# EAGLE design VCNL4000 (EAGLE 5.01)
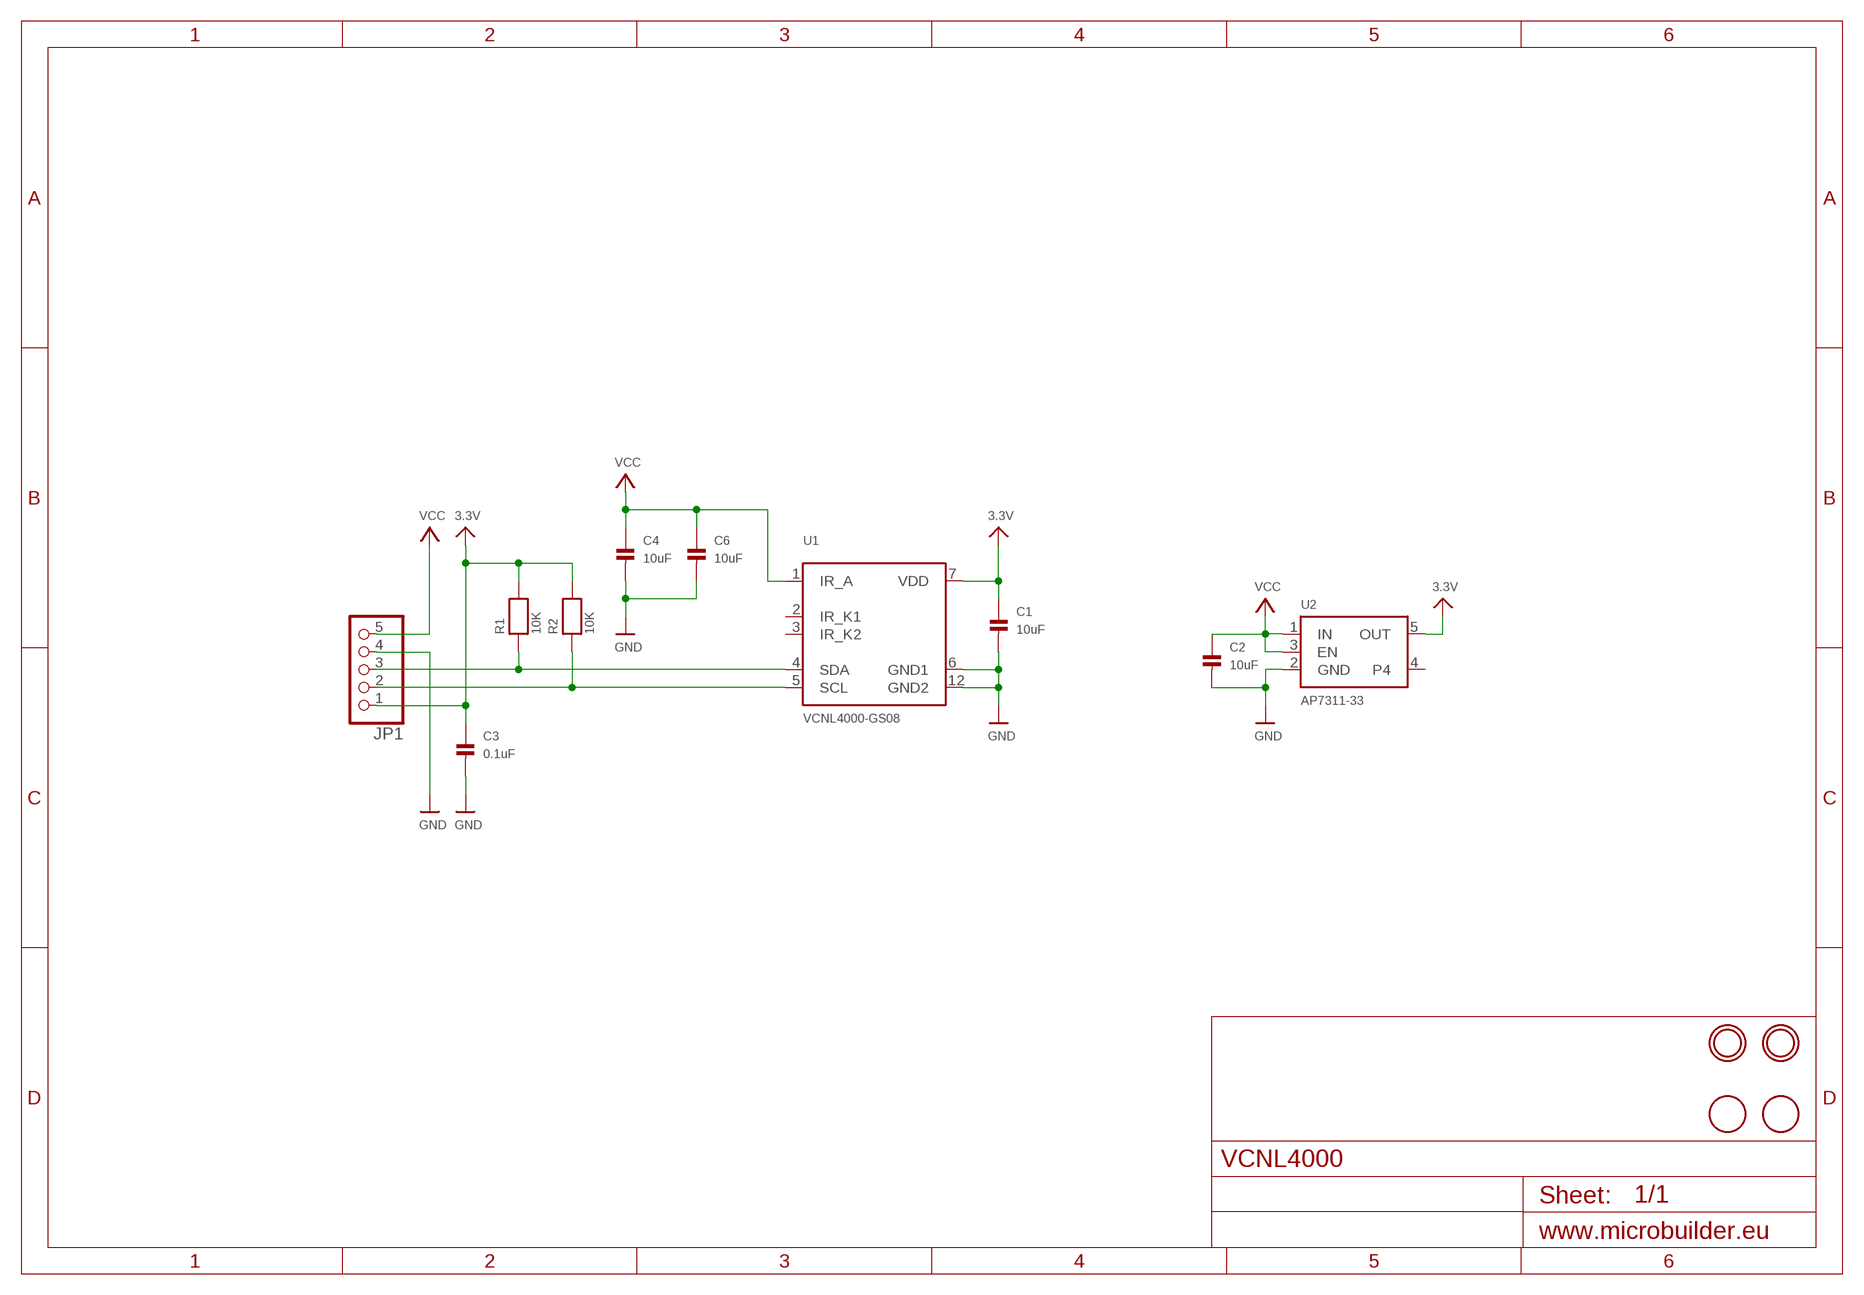
[diagram p0: schematic, sheet 1]

## Parts
C1  10uF  CAP_CERAMIC0805  [0805]
C2  10uF  CAP_CERAMIC0805  [0805]
C3  0.1uF  CAP_CERAMIC0805  [0805]
C4  10uF  CAP_CERAMIC0805  [0805]
C6  10uF  CAP_CERAMIC0805  [0805]
JP1  HEADER-1X576MIL  [1X05_ROUND_76]
R1  10K  RESISTOR0805  [0805]
R2  10K  RESISTOR0805  [0805]
U1  VCNL4000-GS08  VCNL4000  [VCNL4000]
U2  AP7311-33  VREG_SOT23-5  [SOT23-5]
U$5  MOUNTINGHOLE2.0  [MOUNTINGHOLE_2.0_PLATED]
U$6  MOUNTINGHOLE2.0  [MOUNTINGHOLE_2.0_PLATED]
U$7  FIDUCIAL  [FIDUCIAL_1MM]
U$8  FIDUCIAL  [FIDUCIAL_1MM]

## Nets
3.3V: C1.1 C3.1 JP1.1 R1.2 R2.2 U1.7(VDD) U2.5(OUT)
GND: C1.2 C2.2 C3.2 C4.2 C6.2 JP1.4 U1.6(GND1) U1.12(GND2) U2.2(GND)
SCL: JP1.2 R2.1 U1.5(SCL)
SDA: JP1.3 R1.1 U1.4(SDA)
VCC: C2.1 C4.1 C6.1 JP1.5 U1.1(IR_A) U2.1(IN) U2.3(EN)
Unconnected: U1.2(IR_K1) U1.3(IR_K2) U2.4

## Library data of the parts
C1-C4 C6 = microbuilder:CAP_CERAMIC: Ceramic Capacitors 0402 - 0402 Surface Mount Capacitors 16pF 50V 5% [Digikey: 445-4899-2-ND] 18pF 50V 5% [Digikey: 490-1281-2-ND] 22pF 50V 5% [Digikey: 490-1283-2-ND] 68pF 50V 5% [Digikey: 490-1289-2-ND] 0.1uF 10V 10% [Digikey: 490-1318-2-ND] 1.0uF 6.3V 10% [Digikey: 490-1320-2-ND] 0603 - 0603 Surface Mount Capacitors 16 pF 50V 5% [Digikey: 445-5051-2-ND] 22 pF 50V [Digikey: PCC220ACVTR-ND] 33 pF 50V 5% [Digikey: 490-1415-1-ND] 56pF 50V 5% [Digikey: 490-1421-1-ND] 220pF 50V 5% [Digikey: 445-1285-1-ND] 680 pF 50V 2200 pF 50V 5% C0G [Digikey: 445-1297-1-ND] 5600 pF 100V 5% X7R [Digikey: 478-3711-1-ND] 0.1 µF 25V 10% [Digikey: PCC2277TR-ND] 0.22 µF 16V 10% X7R [Digikey: 445-1318-1-ND] 1.0 µF 25V 10% [Digikey: 445-5146-2-ND] 0603 - RF Specific 3pF 250V +/-0.1pF RF [Digikey: 712-1347-1-ND] 18 pF 250V 5% [Digikey: 478-3505-1-ND or 712-1322-1-ND] 56 pF 250V 5% C0G RF [Digikey: 490-4867-1-ND] 68 pF 250V RF [Digikey: 490-4868-1-ND] 0805 - 0805 Surface Mount Capacitors 220 pF 250V 2% RF Ceramic Capacitor [Digikey: 712-1398-1-ND] 1000 pF 50V 2% NP0 Ceramic Capacitor [Digikey: 478-3760-1-ND] 0.1 µF 25V 10% Ceramic Capacitor [Digikey: PCC1828TR-ND] 1.0 µF 16V 10% Ceramic Capacitor[Digikey: 490-1691-2-ND] 10.0 µF 10V 10% Ceramic Capacitor[Digikey: 709-1228-1-ND] 10.0 uF 16V 10% Ceramic Capacitor [Digikey: 478-5165-2-ND] 47 uF 6.3V 20% Ceramic Capacitor [Digikey: 587-1779-1-ND or 399-5506-1-ND] 1206 - 1206 Surface Mount Capacitors 47uF 10V 20% Ceramic Capacitor [Digikey: 490-5528-1-ND or 399-5508-1-ND or 445-6010-1-ND] 100uF 6.3V -20%, +80% Y5V Ceramic Capacitor (Digikey: 490-4512-1-ND, Mouser: 81-GRM31CF50J107ZE1L)
JP1 = microbuilder:HEADER-1X5: PIN HEADER
R1 R2 = microbuilder:RESISTOR: Resistors 0402 - 0402 Surface Mount Package 22 Ohm 1% 1/16W [Digikey: 311-22.0LRTR-ND] 33 Ohm 5% 1/16W 1.0K 5% 1/16W 1.5K 5% 1/16W 2.0K 1% 1/16W 10.0K 1% 1/16W [Digikey: 311-10.0KLRTR-ND] 10.0K 5% 1/16W [Digikey: RMCF0402JT10K0TR-ND] 12.1K 1% 1/16W [Digikey: 311-22.0LRTR-ND] 100.0K 5% 1/16W 0603 - 0603 Surface Mount Package 0 Ohm 1/10 Watt 1% Resistor 15 Ohm 1/10 Watt 1% Resistor 33 Ohm 1/10 Watt 1% Resistor 49.9 Ohm 1/10 Watt 1% Resistor 100 Ohm 1/10 Watt 1% Resistor 150 Ohm 1/10 Watt 1% Resistor 240 Ohm 1/10 Watt 1% Resistor 390 Ohm 1/10 Watt 1% Resistor 560 Ohm 1/10 Watt 1% Resistor 680 Ohm 1/10 Watt 1% Resistor 750 Ohm 1/10 Watt 1% Resistor 1.0K Ohm 1/10 Watt 1% Resistor 1.5K Ohm 1/10 Watt 1% Resistor 2.0K Ohm 1/10 Watt 1% Resistor 2.2K Ohm 1/10 Watt 1% Resistor 3.3K Ohm 1/10 Watt 1% Resistor 4.7K Ohm 1/10 Watt 1% Resistor 10.0K Ohm 1/10 Watt 1% Resistor 12.0K Ohm 1/10 Watt 1% Resistor 12.1K Ohm 1/10 Watt 1% Resistor 20.0K Ohm 1/10 Watt 1% Resistor 33.0K Ohm 1/10 Watt 1% Resistor 100.0K Ohm 1/10 Watt 1% Resistor 0805 - 0805 Surface Mount Package 0 Ohm 1/8 Watt 1% Resistor 33 Ohm 1/8 Watt 1% Resistor 100 Ohm 1/8 Watt 1% Resistor 150 Ohm 1/8 Watt 1% Resistor 200 Ohm 1/8 Watt 1% Resistor 240 Ohm 1/8 Watt 1% Resistor 330 Ohm 1/8 Watt 1% Resistor 390 Ohm 1/8 Watt 1% Resistor 470 Ohm 1/8 Watt 1% Resistor 1.0K Ohm 1/8 Watt 1% Resistor 1.5K Ohm 1/8 Watt 1% Resistor 2.0K Ohm 1/8 Watt 1% Resistor 4.7K Ohm 1/8 Watt 1% Resistor 5.1K Ohm 1/8 Watt 1% Resistor 5.6K Ohm 1/8 Watt 1% Resistor 10.0K Ohm 1/8 Watt 1% Resistor 22.0K Ohm 1/8 Watt 1% Resistor 33.0K Ohm 1/8 Watt 1% Resistor 100K Ohm 1/8 Watt 1% Resistor 1206 - 1206 Surface Mount Package 2012 - 2010 Surface Mount Package 0.11 Ohm 1/2 Watt 1% Resistor - Digikey: RHM.11UCT-ND
U1 = microbuilder:VCNL4000: VCNL4000 - I²C Proximity and Light Sensor Supply: 2.5-3.6V Proximity: up to 200mm Luminosity: 0.25 to 16,000 lux (16-bit values) Digikey: 751-1505-1-ND
U2 = microbuilder:VREG_SOT23-5: SOT23-5 Fixed Voltage Regulators To better organise some of the SOT23-5 fixed voltage regulators in this library, this new part was created. Part Current Out V Out V In V Dropout Digikey Part No. ADP121 150mA 3.3V 3.4-5.5V 0.09V @ 150mA ADP121-AUJZ33R7CT-ND ADP121 150mA 3.0V 3.1-5.5V 0.09V @ 150mA ADP121-AUJZ30R7CT-ND ADP122 300mA 3.3V 3.4-5.5V 0.085V @ 300mA ADP122AUJZ-3.3-R7CT-ND ADP1712 300mA 3.3V 3.5-5.5V 0.17V @ 300mA ADP1712AUJZ-3.3-R7TR-ND AP7311 (Low Cost) 150mA 3.3V 3.5-6V 0.15V @ 150mA AP7311-33WG-7DICT-ND LD39015M18R 150mA 1.8V 1.9V-5.5V 0.08V @ 100mA 497-6977-1-ND MCP1824T-3302E/OT 300mA 3.3V 3.5V-6V 0.2V @ 300mA MCP1824T-3302E/OTCT-ND MIC5205-2.5YM5 TR 150mA 2.5V 2.7-16V 0.165V @ 150mA 576-1257-2-ND MIC5205-3.0YM5 TR 150mA 3.0V 3.2V-16V 0.165V @ 150mA 576-1258-2-ND MIC5205-3.3YM5 TR 150mA 3.3V 3.5V-16V 0.165V @ 150mA 576-1259-2-ND TPS780330220 150mA 3.3V+2.2V 3.6-5.5V 250mV Max 296-23332-1-ND TDA3663/N1,135 100mA 3.3V 3.5-45V 0.18V @ 50mA 568-5343-1-ND
U$5 U$6 = microbuilder:MOUNTINGHOLE: Mounting Hole
U$7 U$8 = adafruit:FIDUCIAL: For use by pick and place machines to calibrate the vision/machine, 1mm By microbuilder.eu

## Board
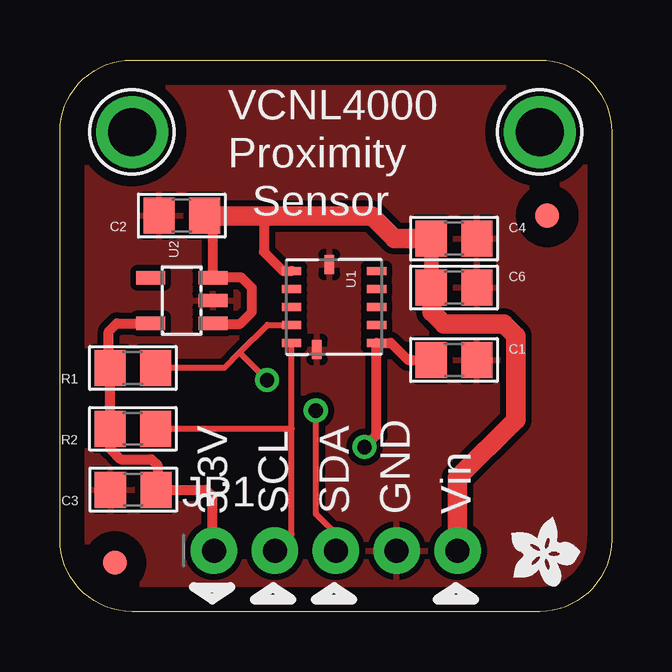
[diagram p1: board, top side]
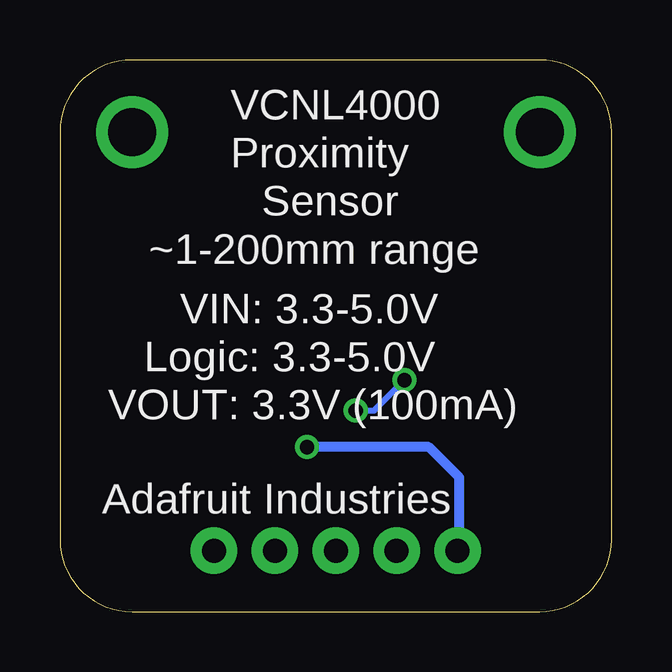
[diagram p2: board, bottom side, seen from below]

Size 23 x 23 mm. Coordinates in mm from the lower left corner, seen from the top.
Outline: 0,3 0,20 arc-90 3,23 20,23 arc-90 23,20 23,3 arc-90 20,0 3,0 arc-90 0,3
Copper layers (1*16): Top 0.035mm / dielectric 1.5mm / Bottom 0.035mm
Design rules "default *": minimum track width 10mil, minimum drill 19mil, track to track 8mil, track to pad 8mil, pad to pad 8mil, via to via 8mil, smd to smd 8mil, copper to edge 40mil, drill to drill 8mil, minimum pad ring 10mil, minimum via ring 8mil, stop-mask expansion 4mil, vias tented up to drill 24mil, thermal gap 10mil

### Footprints (pad centres in the part's own frame; a part is rotated, then mirrored left to right if it is on the bottom)
0805 = smd 1.3 x 1.5: 1 -0.95,0; 2 0.95,0
1X05_ROUND_76 = drill 1 pad 1.93 round: 1 -5.08,0; 2 -2.54,0; 3 0,0; 4 2.54,0; 5 5.08,0
VCNL4000 = smd 0.35 x 0.805: 1 -1.5,-1.772; 2 -0.75,-1.772; 3 0,-1.772; 4 0.75,-1.772; 5 1.5,-1.772; 7 1.5,1.772; 8 0.75,1.772; 9 0,1.772; 10 -0.75,1.772; 11 -1.5,1.772 | smd 0.805 x 0.4: 6 1.772,-0.715; 12 -1.772,-0.2
SOT23-5 = smd 0.55 x 1.2: 1 -0.95,-1.3; 2 0,-1.3; 3 0.95,-1.3; 4 0.95,1.3; 5 -0.95,1.3
MOUNTINGHOLE_2.0_PLATED = drill 2 pad 3 round: P$1 0,0
FIDUCIAL_1MM = smd 1 x 1: 1 0,0

### Placement (x,y rotation side)
C1  16.43,10.49 0 top
C2  5.08,16.51 180 top
C3  3.06,5.08 180 top
C4  16.43,15.55 0 top
C6  16.43,13.51 0 top
JP1  11.5,2.54 0 top
R1  3.04,10.16 180 top
R2  3.04,7.62 180 top
U1  11.43,12.7 270 top
U2  5.08,12.97 90 top
U$5  3,20 0 top
U$6  20,20 0 top
U$7  20.32,16.51 0 top
U$8  2.29,2.03 0 top
U$13  [ADAFRUIT200MIL]  20.23,2.6 270 top

### Tracks (layer width: path | path; a pad name or v marks a point on that pad's centre or on a via)
3.3V  (via drill 0.6)
  Top 0.406: C1.1 14.5,10.5 13.8,11.2 U1.7 13.2,7.36 v12.7,6.86 | U2.5 2.37,12.02 2.03,11.68 2.03,10.22 R1.2 R2.2 2.09,6.8 2.54,6.35 3.81,6.35 4.06,6.1 4.06,5.14 C3.1 6.1,5.08 6.35,4.83 6.35,2.61 JP1.1
  Bottom 0.406: v12.7,6.86 7.62,6.86 6.35,5.59 6.35,2.61 JP1.1
GND
  pour Top (isolate 0.254): 0,23 23,23 23,0 0,0
SCL
  Top 0.254: 9.66,7.62 9.66,3.24 JP1.2 | 9.66,7.62 U1.5 | 9.66,7.62 R2.1
SDA  (via drill 0.6)
  Top 0.254: U1.4 8.65,11.95 7.49,10.79 | 7.49,10.79 6.86,10.16 R1.1 | JP1.3 11.5,3.23 10.67,4.06 v10.67,8.38 | v8.64,9.65 7.49,10.79
  Bottom 0.254: v10.67,8.38 9.91,8.38 v8.64,9.65
VCC
  Top 0.406: U2.1 6.4,12 7.5,12 8,12.5 8,13.5 7.58,13.92 U2.3 6.38,16.16 C2.1 | U1.1 9.3,14.2 8.5,15 8.5,16.5
  Top 0.61: C4.1 C6.1
  Top 0.813: JP1.5 16.58,5.58 19,8 19,11.5 18.5,12 16,12 15.5,12.5 15.5,13.49 C6.1 | C4.1 13.95,15.55 13,16.5 8.5,16.5 C2.1

### Text on the board
tPlace: VCNL4000 | Proximity | Sensor | 3.3V | SCL | SDA | GND | Vin
bPlace: VCNL4000 | Proximity | Sensor | ~1-200mm range | VIN: 3.3-5.0V | Logic: 3.3-5.0V | VOUT: 3.3V (100mA) | Adafruit Industries